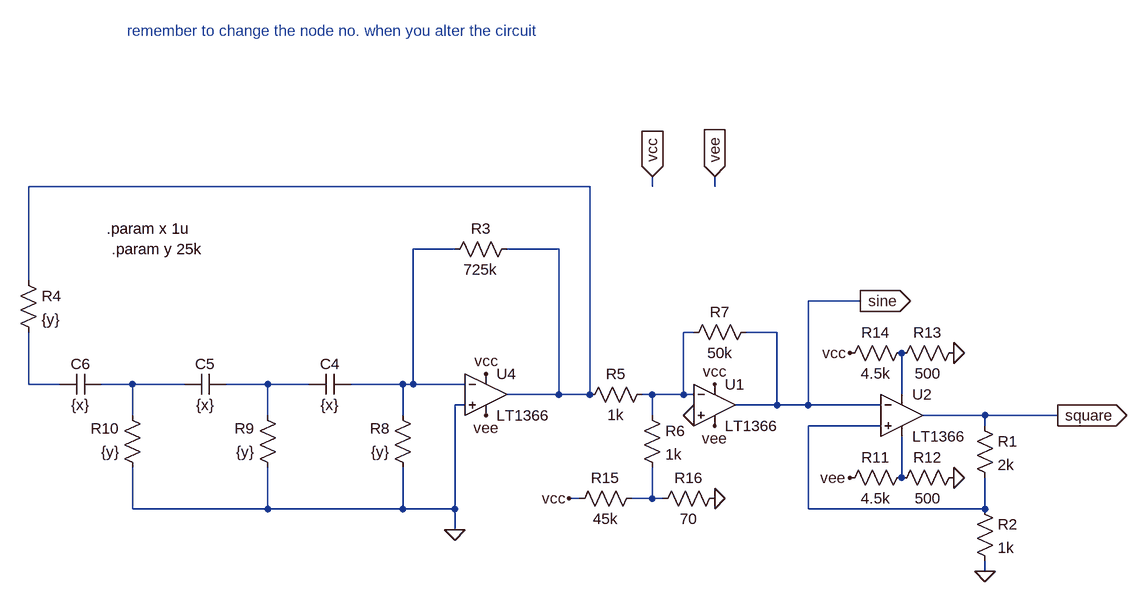
[diagram p0: schematic lfo_FM.asc]
lfo_FM.asc, the LTspice schematic file:
Version 4
SHEET 1 1144 880
WIRE -576 -144 -1440 -144
WIRE -480 -144 -480 -160
WIRE -384 -144 -384 -160
WIRE -784 -48 -848 -48
WIRE -624 -48 -704 -48
WIRE -1440 0 -1440 -144
WIRE -160 32 -240 32
WIRE -416 80 -432 80
WIRE -288 80 -336 80
WIRE -1440 160 -1440 80
WIRE -1392 160 -1440 160
WIRE -1280 160 -1328 160
WIRE -1200 160 -1280 160
WIRE -1072 160 -1136 160
WIRE -1008 160 -1072 160
WIRE -864 160 -944 160
WIRE -848 160 -848 -48
WIRE -848 160 -864 160
WIRE -768 160 -848 160
WIRE -624 176 -624 -48
WIRE -624 176 -704 176
WIRE -576 176 -576 -144
WIRE -576 176 -624 176
WIRE -480 176 -496 176
WIRE -432 176 -432 80
WIRE -432 176 -480 176
WIRE -416 176 -432 176
WIRE -96 176 -96 112
WIRE -768 192 -784 192
WIRE -288 192 -288 80
WIRE -288 192 -352 192
WIRE -240 192 -240 32
WIRE -240 192 -288 192
WIRE -128 192 -240 192
WIRE -1280 208 -1280 160
WIRE -1072 208 -1072 160
WIRE -864 208 -864 160
WIRE -480 208 -480 176
WIRE 32 208 -64 208
WIRE 144 208 32 208
WIRE -128 224 -240 224
WIRE 32 224 32 208
WIRE -96 304 -96 240
WIRE -592 336 -608 336
WIRE -480 336 -480 288
WIRE -480 336 -512 336
WIRE -464 336 -480 336
WIRE -1280 352 -1280 288
WIRE -1072 352 -1072 288
WIRE -1072 352 -1280 352
WIRE -864 352 -864 288
WIRE -864 352 -1072 352
WIRE -784 352 -784 192
WIRE -784 352 -864 352
WIRE -240 352 -240 224
WIRE 32 352 32 304
WIRE 32 352 -240 352
WIRE -784 384 -784 352
WIRE 32 448 32 432
FLAG 32 448 0
FLAG -784 384 0
FLAG -480 -160 vcc
IOPIN -480 -160 In
FLAG -384 -160 vee
IOPIN -384 -160 In
FLAG -736 144 vcc
FLAG -736 208 vee
FLAG 144 208 square
IOPIN 144 208 Out
FLAG -160 32 sine
IOPIN -160 32 Out
FLAG -416 208 0
FLAG -384 160 vcc
FLAG -384 224 vee
FLAG -16 112 0
FLAG -16 304 0
FLAG -176 112 vcc
FLAG -176 304 vee
FLAG -384 336 0
FLAG -608 336 vcc
SYMBOL res 16 208 R0
SYMATTR InstName R1
SYMATTR Value 2k
SYMBOL res 16 336 R0
SYMATTR InstName R2
SYMATTR Value 1k
SYMBOL cap -944 144 R90
WINDOW 0 0 32 VBottom 2
WINDOW 3 32 32 VTop 2
SYMATTR InstName C4
SYMATTR Value {x}
SYMBOL cap -1136 144 R90
WINDOW 0 0 32 VBottom 2
WINDOW 3 32 32 VTop 2
SYMATTR InstName C5
SYMATTR Value {x}
SYMBOL cap -1328 144 R90
WINDOW 0 0 32 VBottom 2
WINDOW 3 32 32 VTop 2
SYMATTR InstName C6
SYMATTR Value {x}
SYMBOL res -848 304 R180
WINDOW 0 36 76 Left 2
WINDOW 3 36 40 Left 2
SYMATTR InstName R8
SYMATTR Value {y}
SYMBOL res -1056 304 R180
WINDOW 0 36 76 Left 2
WINDOW 3 36 40 Left 2
SYMATTR InstName R9
SYMATTR Value {y}
SYMBOL res -1264 304 R180
WINDOW 0 36 76 Left 2
WINDOW 3 36 40 Left 2
SYMATTR InstName R10
SYMATTR Value {y}
SYMBOL Opamps/LT1366 -736 112 R0
SYMATTR InstName U4
SYMBOL Opamps/LT1366 -96 144 R0
SYMATTR InstName U2
SYMBOL res -688 -64 R90
WINDOW 0 0 56 VBottom 2
WINDOW 3 32 56 VTop 2
SYMATTR InstName R3
SYMATTR Value 725k
SYMBOL Opamps/LT1366 -384 128 R0
SYMATTR InstName U1
SYMBOL res -480 160 R90
WINDOW 0 0 56 VBottom 2
WINDOW 3 32 56 VTop 2
SYMATTR InstName R5
SYMATTR Value 1k
SYMBOL res -496 192 R0
SYMATTR InstName R6
SYMATTR Value 1k
SYMBOL res -320 64 R90
WINDOW 0 0 56 VBottom 2
WINDOW 3 32 56 VTop 2
SYMATTR InstName R7
SYMATTR Value 50k
SYMBOL res -80 288 R90
WINDOW 0 0 56 VBottom 2
WINDOW 3 32 56 VTop 2
SYMATTR InstName R11
SYMATTR Value 4.5k
SYMBOL res 0 288 R90
WINDOW 0 0 56 VBottom 2
WINDOW 3 32 56 VTop 2
SYMATTR InstName R12
SYMATTR Value 500
SYMBOL res 0 96 R90
WINDOW 0 0 56 VBottom 2
WINDOW 3 32 56 VTop 2
SYMATTR InstName R13
SYMATTR Value 500
SYMBOL res -80 96 R90
WINDOW 0 0 56 VBottom 2
WINDOW 3 32 56 VTop 2
SYMATTR InstName R14
SYMATTR Value 4.5k
SYMBOL res -1456 -16 R0
SYMATTR InstName R4
SYMATTR Value {y}
SYMBOL res -608 352 R270
WINDOW 0 32 56 VTop 2
WINDOW 3 0 56 VBottom 2
SYMATTR InstName R15
SYMATTR Value 45k
SYMBOL res -480 352 R270
WINDOW 0 32 56 VTop 2
WINDOW 3 0 56 VBottom 2
SYMATTR InstName R16
SYMATTR Value 70
TEXT -1320 -80 Left 2 !.param x 1u
TEXT -1312 -48 Left 2 !.param y 25k
TEXT -1288 -384 Left 2 ;remember to change the node no. when you alter the circuit

The netlist it stands for:
* lfo_FM.asc
R1 square N008 2k
R2 N008 0 1k
C4 N002 N006 {x}
C5 N006 N005 {x}
C6 N005 N004 {x}
R8 0 N002 {y}
R9 0 N006 {y}
R10 0 N005 {y}
XU4 0 N002 vcc vee N001 LT1366  ; pins In+ In- V+ V- OUT
XU2 N008 sine N007 N009 square LT1366  ; pins In+ In- V+ V- OUT
R3 N001 N002 725k
XU1 0 N003 vcc vee sine LT1366  ; pins In+ In- V+ V- OUT
R5 N003 N001 1k
R6 N003 N010 1k
R7 sine N003 50k
R11 N009 vee 4.5k
R12 0 N009 500
R13 0 N007 500
R14 N007 vcc 4.5k
R4 N001 N004 {y}
R15 vcc N010 45k
R16 N010 0 70
.param x 1u
.param y 25k
* remember to change the node no. when you alter the circuit
.lib LTC.lib
.backanno
.end